# EAGLE design BatteryManagement_neu (EAGLE 6.0)
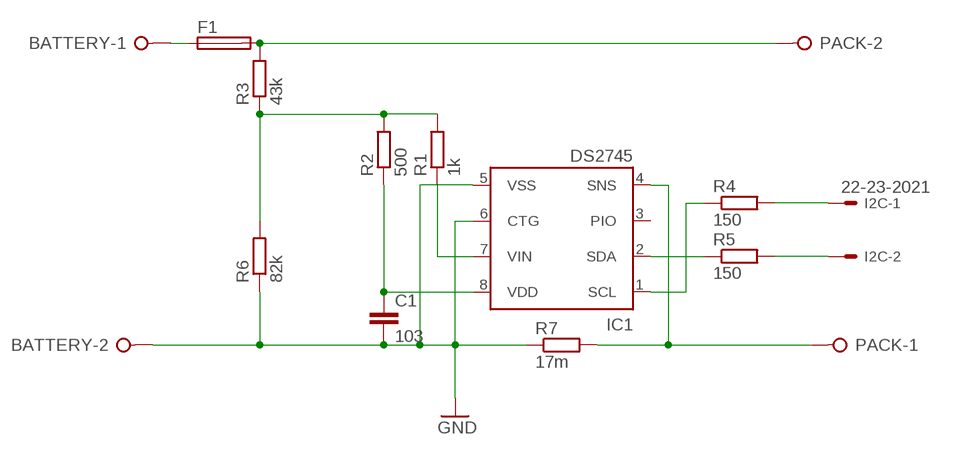
[diagram p0: schematic, sheet 1]

## Parts
BATTERY  W237-02P  [W237-132]
C1  103  C-EU050-030X075  [C050-030X075]
F1  SH22,5  [SH22,5]
I2C  22-23-2021  [22-23-2021]
IC1  DS2745  [UMAX10]
PACK  W237-02P  [W237-132]
R1  1k  R-EU_0207/10  [0207/10]
R2  500  R-EU_0207/10  [0207/10]
R3  43k  R-EU_0207/10  [0207/10]
R4  150  R-EU_0207/10  [0207/10]
R5  150  R-EU_0207/10  [0207/10]
R6  82k  R-EU_0207/10  [0207/10]
R7  17m  R-EU_R2010  [R2010]

## Nets
GND: BATTERY.2 C1.2 IC1.5(VSS) IC1.6(CTG) R6.1 R7.1
N$1: I2C.1 R4.2
N$2: I2C.2 R5.2
N$3: IC1.1(SCL) R4.1
N$4: IC1.2(SDA) R5.1
N$5: BATTERY.1 F1.1
N$6: IC1.7(VIN) R1.1
N$7: C1.1 IC1.8(VDD) R2.1
N$8: IC1.4(SNS) PACK.1 R7.2
N$9: F1.2 PACK.2 R3.2
N$10: R1.2 R2.2 R3.1 R6.2
Unconnected: IC1.3(PIO)

## Library data of the parts
BATTERY PACK = con-wago-508:W237-02P: WAGO SREW CLAMP; OC_FARNELL: unknown; OC_NEWARK: unknown
C1 = rcl:C-EU: CAPACITOR, European symbol
F1 = fuse:SH22,5: FUSE HOLDER grid 22,5 mm, OGN0031 8201, Schurter (Buerklin); MF: SCHURTER; MPN: 0031.8201; OC_FARNELL: 1162740; OC_NEWARK: 96F8317
I2C = con-molex:22-23-2021: .100" (2.54mm) Center Header - 2 Pin; MF: MOLEX; MPN: 22-23-2021; OC_FARNELL: 1462926; OC_NEWARK: 25C3832
IC1 = DS2745:DS2745: Low-Cost I²C Battery Monitor in µMAX Source: http://www.maxim-ic.com .. DS2745.pdf
R1-R7 = rcl:R-EU_: RESISTOR, European symbol

## Board
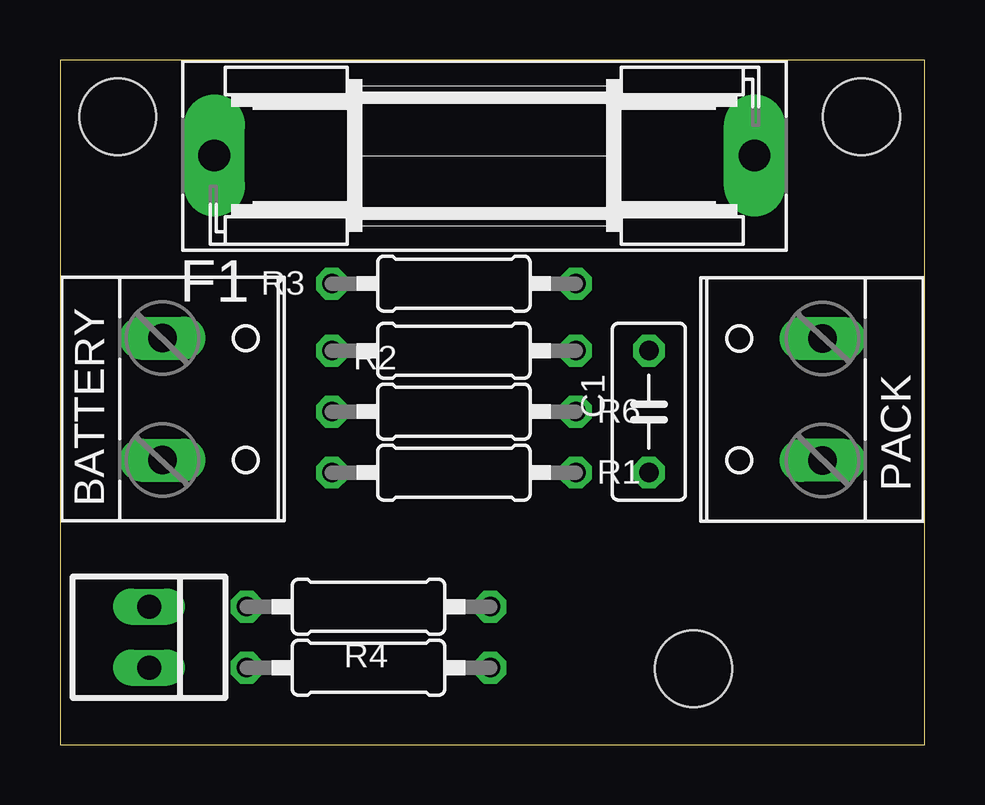
[diagram p1: board, top side]
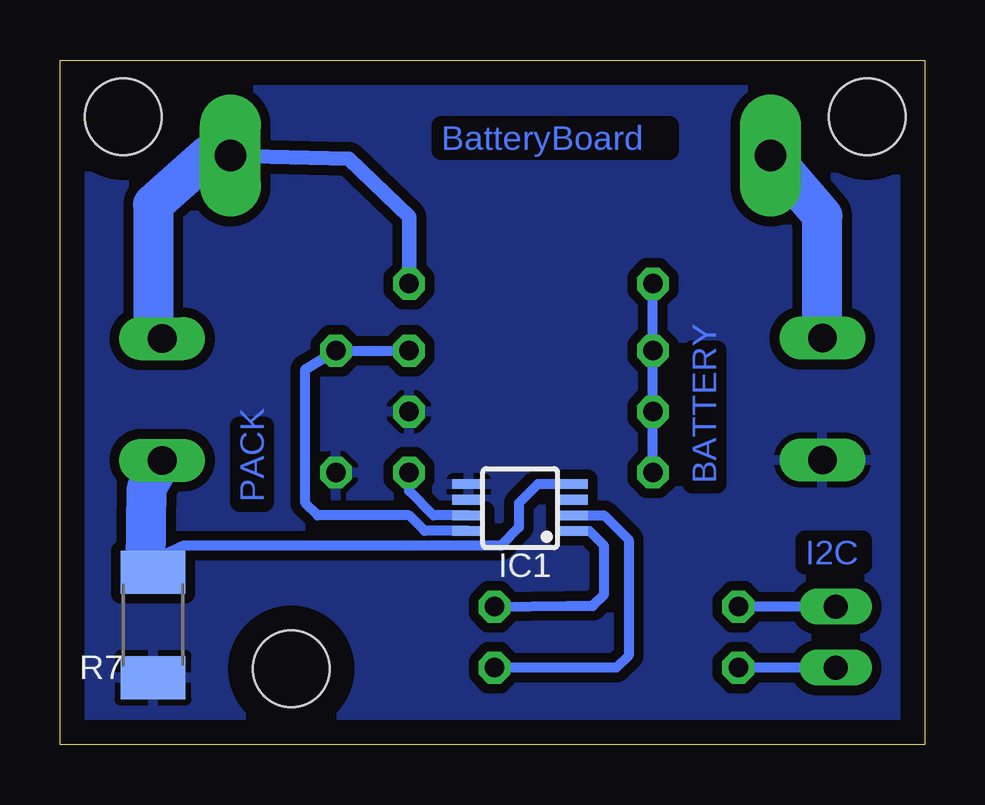
[diagram p2: board, bottom side, seen from below]

Size 36.03 x 28.54 mm. Coordinates in mm from the lower left corner, seen from the top.
Outline: 0,0.01 36.03,0 36.03,28.52 0,28.54 0,0.01
Copper layers (1*16): Top 0.035mm / dielectric 1.5mm / Bottom 0.035mm
Design rules: minimum track width 10mil, minimum drill 24mil, track to track 8mil, track to pad 8mil, pad to pad 8mil, via to via 8mil, smd to smd 8mil, copper to edge 40mil, drill to drill 8mil, minimum pad ring 10mil, minimum via ring 8mil, stop-mask expansion 4mil, vias tented up to drill 0mil, thermal gap 10mil
Holes 3.2 mm at 2.4,26.17 33.4,26.17 26.4,3.17

### Footprints (pad centres in the part's own frame; a part is rotated, then mirrored left to right if it is on the bottom)
W237-132 = drill 1.194 long: 1 -2.54,-0.635; 2 2.54,-0.635
C050-030X075 = drill 0.813 octagon: 1 -2.54,0; 2 2.54,0
SH22,5 = drill 1.321 pad 2.54 long: 1 -11.252,0; 2 11.252,0
22-23-2021 = drill 1 long: 1 -1.27,0; 2 1.27,0
UMAX10 = smd 1.35 x 0.4: 1 1.7,-0.65; 2 1.7,0; 3 1.7,0.65; 4 1.7,1.3; 5 -2.6,1.3; 6 -2.6,0.65; 7 -2.6,0; 8 -2.6,-0.65
0207/10 = drill 0.813 octagon: 1 -5.08,0; 2 5.08,0
R2010 = smd 1.8 x 2.7: 1 -2.2,0; 2 2.2,0

### Placement (x,y rotation side)
BATTERY  4.9,14.41 270 top
C1  24.54,13.88 270 top
F1  17.68,24.55 0 top
I2C  3.71,4.49 270 top
IC1  16.41,9.57 0 bottom
PACK  31.14,14.39 90 top
R1  16.41,11.34 180 top
R2  16.41,16.43 180 top
R3  16.41,19.22 0 top
R4  12.85,5.76 180 top
R5  12.85,3.22 180 top
R6  16.41,13.88 180 top
R7  32.16,5 90 bottom

### Tracks (layer width: path | path; a pad name or v marks a point on that pad's centre or on a via)
GND
  pour Bottom (isolate 0.406): -0.6,29.16 -0.6,-0.08 36.4,0.17 36.4,29.16
N$1
  Bottom 0.406: I2C.1 R4.2
N$2
  Bottom 0.406: I2C.2 R5.2
N$3
  Bottom 0.406: R4.1 14.89,5.79 13.84,5.79 13.36,6.26 13.36,8.3 13.98,8.92 IC1.1
N$4
  Bottom 0.406: IC1.2 13.36,9.57 12.35,8.55 12.35,3.73 12.85,3.22 R5.1
N$5
  Bottom 1.676: BATTERY.1 4.27,22.04 F1.1
N$6
  Bottom 0.406: IC1.7 20.47,9.57 21.49,10.58 R1.1
N$7
  Bottom 0.406: R2.1 C1.1 25.81,15.66 25.81,10.07 25.3,9.57 21.49,9.57 20.84,8.92 IC1.8
N$8
  Bottom 0.406: IC1.4 16.13,10.87 16.92,10.07 16.92,9.06 17.68,8.3 30.92,8.3 32.46,7.55
  Bottom 1.676: R7.2 32.46,7.55 32.41,10.71 PACK.1
N$9
  Bottom 0.61: F1.2 24,24.42 21.49,22.01 R3.2
  Bottom 1.676: F1.2 29.87,24.55 32.16,22.52 32.16,17.06 PACK.2
N$10
  Bottom 0.406: R1.2 R6.2 R2.2 R3.1

### Text on the board
Bottom: BatteryBoard | BATTERY | PACK | I2C
bRestrict: BatteryBoard | BATTERY | PACK | I2C